# EAGLE design V001 (EAGLE 9.3.1)
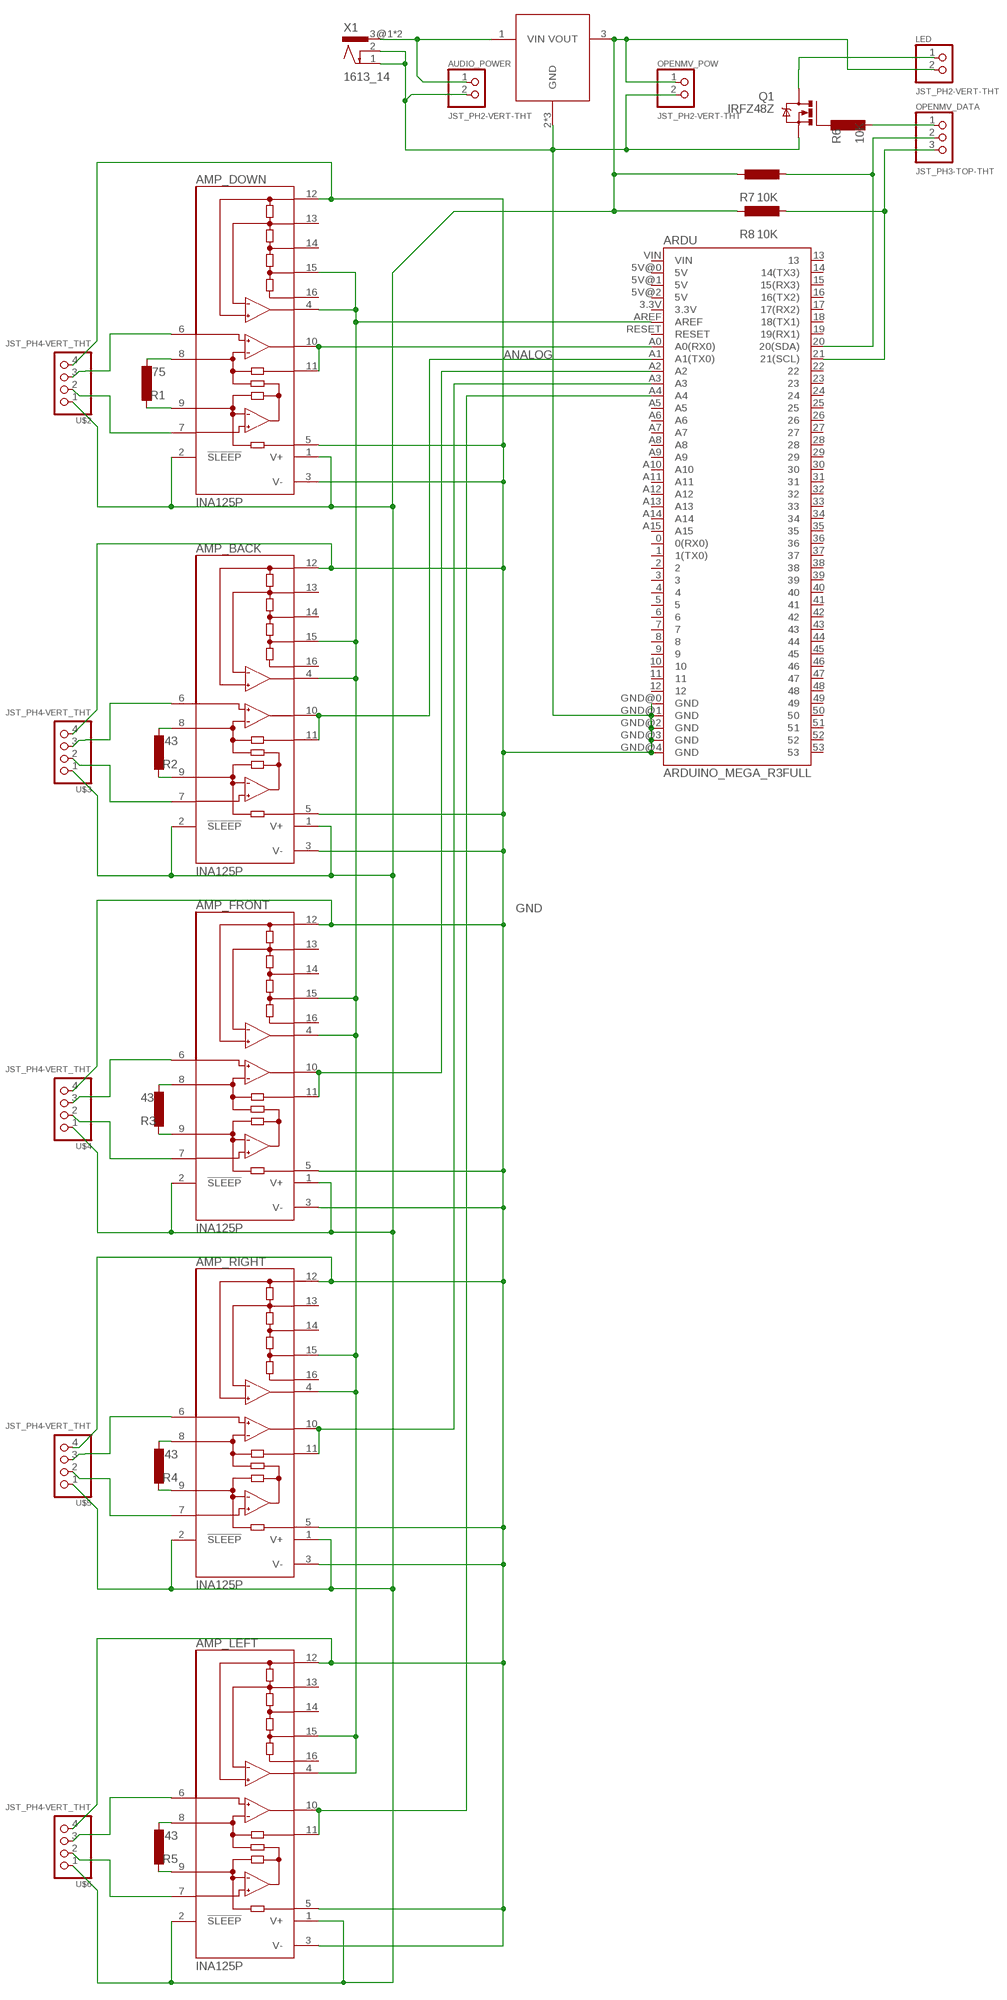
[diagram p0: schematic, sheet 1]

## Parts
AMP_BACK  INA125P  [DIL16]
AMP_DOWN  INA125P  [DIL16]
AMP_FRONT  INA125P  [DIL16]
AMP_LEFT  INA125P  [DIL16]
AMP_RIGHT  INA125P  [DIL16]
ARDU  ARDUINO_MEGA_R3FULL  [ARDUINO_MEGA]
AUDIO_POWER  JST_PH2-VERT-THT  [B2B-PH-K-S]
LED  JST_PH2-VERT-THT  [B2B-PH-K-S]
OPENMV_DATA  JST_PH3-TOP-THT  [B3B-PH-K-S]
OPENMV_POW  JST_PH2-VERT-THT  [B2B-PH-K-S]
Q1  IRFZ48Z  [TO220BH]
R1  75  L-EU0207/10  [0207/10]
R2  43  L-EU0207/10  [0207/10]
R3  43  L-EU0207/10  [0207/10]
R4  43  L-EU0207/10  [0207/10]
R5  43  L-EU0207/10  [0207/10]
R6  10K  L-EU0207/10  [0207/10]
R7  10K  L-EU0207/10  [0207/10]
R8  10K  L-EU0207/10  [0207/10]
U$1  TL780  [TO254P1651X1067X470-3]
U$2  JST_PH4-VERT_THT  [B4B-PH-K-S]
U$3  JST_PH4-VERT_THT  [B4B-PH-K-S]
U$4  JST_PH4-VERT_THT  [B4B-PH-K-S]
U$5  JST_PH4-VERT_THT  [B4B-PH-K-S]
U$6  JST_PH4-VERT_THT  [B4B-PH-K-S]
X1  1613_14  [1613_14]

## Nets
5V: AMP_BACK.1(V+) AMP_BACK.2(!SLEEP) AMP_DOWN.1(V+) AMP_DOWN.2(!SLEEP) AMP_FRONT.1(V+) AMP_FRONT.2(!SLEEP) AMP_LEFT.1(V+) AMP_LEFT.2(!SLEEP) AMP_RIGHT.1(V+) AMP_RIGHT.2(!SLEEP) LED.2 OPENMV_POW.1 R7.1 R8.1 U$1.3(VOUT) U$2.1 U$3.1 U$4.1 U$5.1 U$6.1
12V: AUDIO_POWER.1 U$1.1(VIN) X1.3@1 X1.3@2
ANALOG: AMP_DOWN.10(OUT) AMP_DOWN.11(SENSE) ARDU.A0(A0(RX0))
AREF: AMP_BACK.4(REFOUT) AMP_BACK.15(REF5) AMP_DOWN.4(REFOUT) AMP_DOWN.15(REF5) AMP_FRONT.4(REFOUT) AMP_FRONT.15(REF5) AMP_LEFT.4(REFOUT) AMP_LEFT.15(REF5) AMP_RIGHT.4(REFOUT) AMP_RIGHT.15(REF5) ARDU.AREF
GND: AMP_BACK.3(V-) AMP_BACK.5(REF) AMP_BACK.12(REFCOM) AMP_DOWN.3(V-) AMP_DOWN.5(REF) AMP_DOWN.12(REFCOM) AMP_FRONT.3(V-) AMP_FRONT.5(REF) AMP_FRONT.12(REFCOM) AMP_LEFT.3(V-) AMP_LEFT.5(REF) AMP_LEFT.12(REFCOM) AMP_RIGHT.3(V-) AMP_RIGHT.5(REF) AMP_RIGHT.12(REFCOM) ARDU.GND@0(GND) ARDU.GND@1(GND) ARDU.GND@2(GND) ARDU.GND@3(GND) ARDU.GND@4(GND) AUDIO_POWER.2 OPENMV_POW.2 Q1.S U$1.2(GND) U$1.4(GND) U$1.4.1(GND) U$2.4 U$3.4 U$4.4 U$5.4 U$6.4 X1.1 X1.2
N$3: AMP_DOWN.8(RG) R1.2
N$4: AMP_DOWN.9(RG) R1.1
N$5: AMP_BACK.8(RG) R2.2
N$6: AMP_BACK.9(RG) R2.1
N$7: AMP_DOWN.6(+IN) U$2.3
N$8: AMP_FRONT.8(RG) R3.2
N$9: AMP_FRONT.9(RG) R3.1
N$10: AMP_FRONT.10(OUT) AMP_FRONT.11(SENSE) ARDU.A2
N$11: AMP_RIGHT.8(RG) R4.2
N$12: AMP_RIGHT.9(RG) R4.1
N$13: AMP_RIGHT.10(OUT) AMP_RIGHT.11(SENSE) ARDU.A3
N$14: AMP_LEFT.8(RG) R5.2
N$15: AMP_LEFT.9(RG) R5.1
N$16: AMP_LEFT.10(OUT) AMP_LEFT.11(SENSE) ARDU.A4
N$17: AMP_DOWN.7(-IN) U$2.2
N$18: OPENMV_DATA.1 R6.2
N$19: AMP_BACK.10(OUT) AMP_BACK.11(SENSE) ARDU.A1(A1(TX0))
N$20: AMP_BACK.6(+IN) U$3.3
N$21: AMP_BACK.7(-IN) U$3.2
N$22: AMP_FRONT.6(+IN) U$4.3
N$23: AMP_FRONT.7(-IN) U$4.2
N$24: AMP_RIGHT.6(+IN) U$5.3
N$25: AMP_RIGHT.7(-IN) U$5.2
N$26: AMP_LEFT.6(+IN) U$6.3
N$27: AMP_LEFT.7(-IN) U$6.2
N$28: Q1.G R6.1
N$29: LED.1 Q1.D
N$30: ARDU.20(20(SDA)) OPENMV_DATA.2 R7.2
N$32: ARDU.21(21(SCL)) OPENMV_DATA.3 R8.2
Unconnected: AMP_BACK.13(REFBG) AMP_BACK.14(REF2.5) AMP_BACK.16(REF10) AMP_DOWN.13(REFBG) AMP_DOWN.14(REF2.5) AMP_DOWN.16(REF10) AMP_FRONT.13(REFBG) AMP_FRONT.14(REF2.5) AMP_FRONT.16(REF10) AMP_LEFT.13(REFBG) AMP_LEFT.14(REF2.5) AMP_LEFT.16(REF10) AMP_RIGHT.13(REFBG) AMP_RIGHT.14(REF2.5) AMP_RIGHT.16(REF10) ARDU.0(0(RX0)) ARDU.1(1(TX0)) ARDU.2 ARDU.3 ARDU.3.3V ARDU.4 ARDU.5 ARDU.5V@0(5V) ARDU.5V@1(5V) ARDU.5V@2(5V) ARDU.6 ARDU.7 ARDU.8 ARDU.9 ARDU.10 ARDU.11 ARDU.12 ARDU.13 ARDU.14(14(TX3)) ARDU.15(15(RX3)) ARDU.16(16(TX2)) ARDU.17(17(RX2)) ARDU.18(18(TX1)) ARDU.19(19(RX1)) ARDU.22 ARDU.23 ARDU.24 ARDU.25 ARDU.26 ARDU.27 ARDU.28 ARDU.29 ARDU.30 ARDU.31 ARDU.32 ARDU.33 ARDU.34 ARDU.35 ARDU.36 ARDU.37 ARDU.38 ARDU.39 ARDU.40 ARDU.41 ARDU.42 ARDU.43 ARDU.44 ARDU.45 ARDU.46 ARDU.47 ARDU.48 ARDU.49 ARDU.50 ARDU.51 ARDU.52 ARDU.53 ARDU.A5 ARDU.A6 ARDU.A7 ARDU.A8 ARDU.A9 ARDU.A10 ARDU.A11 ARDU.A12 ARDU.A13 ARDU.A14 ARDU.A15 ARDU.RESET ARDU.VIN

## Library data of the parts
AMP_BACK AMP_DOWN AMP_FRONT AMP_LEFT AMP_RIGHT = burr-brown:INA125: Instrumentation Amplifier with Precision Voltage Reference; MF: TEXAS INSTRUMENT CONNECTORS; MPN: INA125P; OC_FARNELL: 1459461; OC_NEWARK: 35C1726
ARDU = SparkFun-Boards:ARDUINO_MEGA_R3: Arduino Mega R3 ATmega2560 R3 compatible footprint. SparkFun Products: Arduino Mega 2560 R3 <https://www.sparkfun.com/products/11061>
AUDIO_POWER LED OPENMV_POW = ICST:JST_PH2
OPENMV_DATA = ICST:JST_PH3
Q1 = transistor-power:IRFZ48: N Channel HEXFET® Power MOSFET Logic Level Source: http://www.irf.com/product-info/datasheets/data/irfz48z.pdf
R1-R8 = rcl:L-EU: INDUCTOR, European symbol; SPICEPREFIX: L
U$1 = TO254P1651X1067X470-3:TL780
U$2-U$6 = ICST:JST_PH4
X1 = con-lumberg:1613_14: Power supply connectors / Netzgeräte-Steckverbinder Source: Data sheet <http://www.farnell.com/datasheets/1733496.pdf>; MF: LUMBERG; MPN: 1613 14; OC_FARNELL: 1243245

## Board
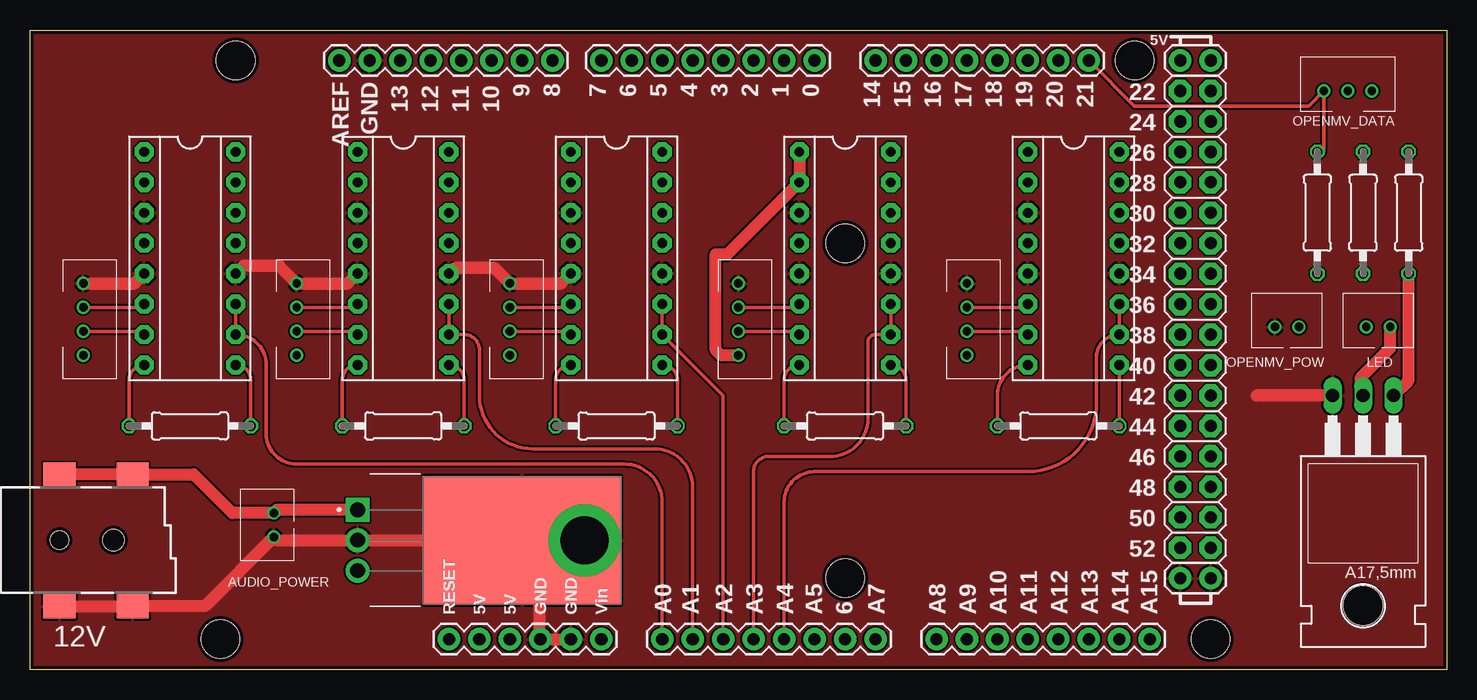
[diagram p1: board, top side]
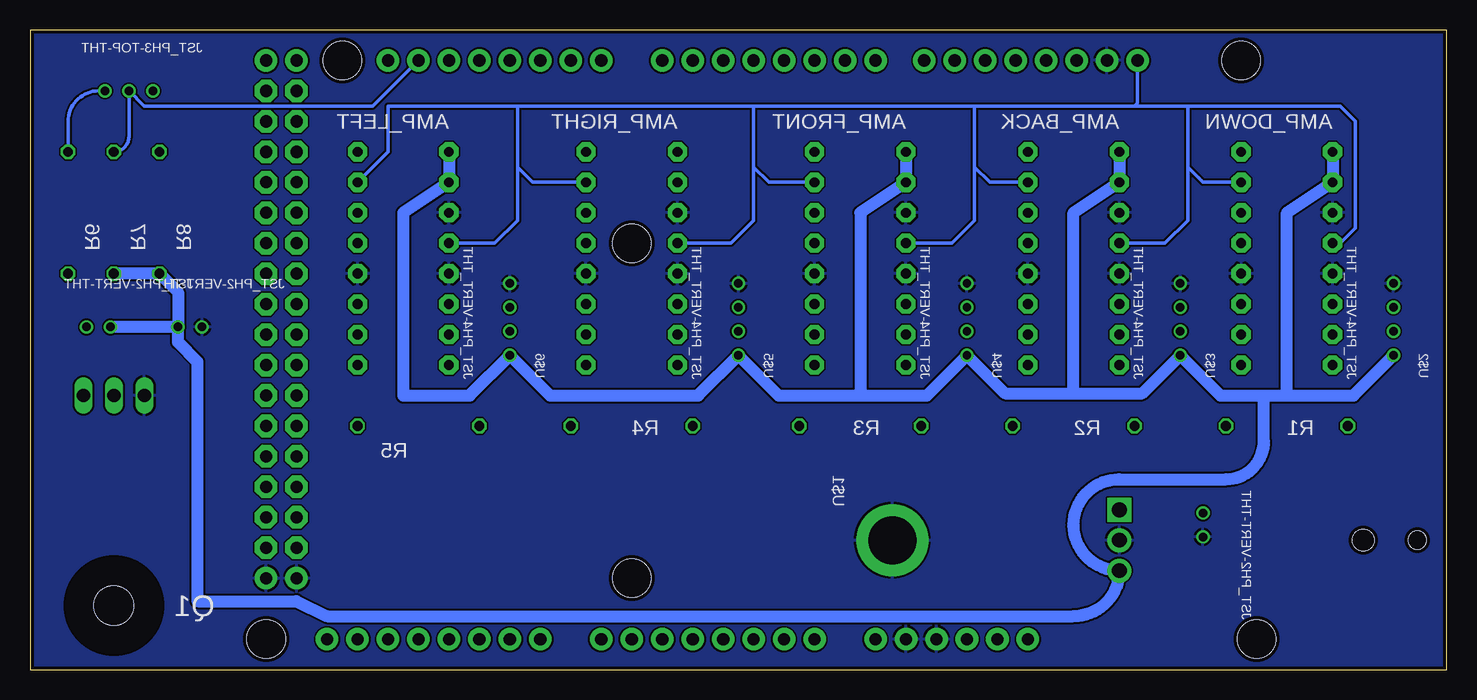
[diagram p2: board, bottom side, seen from below]

Size 118.11 x 53.34 mm. Coordinates in mm from the lower left corner, seen from the top.
Outline: 0,53.34 118.11,53.34 118.11,0 0,0 0,53.34
Copper layers (1*16): Top 0.035mm / dielectric 1.5mm / Bottom 0.035mm
Design rules "PCB-POOL Standard": minimum track width 0.15mm, minimum drill 0.3mm, track to track 0.15mm, track to pad 0.15mm, pad to pad 0.15mm, via to via 0.15mm, smd to smd 0.15mm, copper to edge 0.3mm, drill to drill 0.2mm, minimum pad ring 0.2mm, minimum via ring 0.15mm, stop-mask expansion 0.075mm, vias tented up to drill 0mil, thermal gap 0.2mm

### Footprints (pad centres in the part's own frame; a part is rotated, then mirrored left to right if it is on the bottom)
DIL16 = drill 0.813 pad 1.6 octagon: 1 -8.89,-3.81; 2 -6.35,-3.81; 3 -3.81,-3.81; 4 -1.27,-3.81; 5 1.27,-3.81; 6 3.81,-3.81; 7 6.35,-3.81; 8 8.89,-3.81; 9 8.89,3.81; 10 6.35,3.81; 11 3.81,3.81; 12 1.27,3.81; 13 -1.27,3.81; 14 -3.81,3.81; 15 -6.35,3.81; 16 -8.89,3.81
ARDUINO_MEGA = drill 1.016 pad 1.88: 0 13.97,24.13; 1 11.43,24.13; 2 8.89,24.13; 3 6.35,24.13; 3.3V -13.97,-24.13; 4 3.81,24.13; 5 1.27,24.13; 5V@0 -11.43,-24.13; 5V@1 44.45,24.13; 5V@2 46.99,24.13; 6 -1.27,24.13; 7 -3.81,24.13; 8 -7.874,24.13; 9 -10.414,24.13; 10 -12.954,24.13; 11 -15.494,24.13; 12 -18.034,24.13; 13 -20.574,24.13; 14 19.05,24.13; 15 21.59,24.13; 16 24.13,24.13; 17 26.67,24.13; 18 29.21,24.13; 19 31.75,24.13; 20 34.29,24.13; 21 36.83,24.13; A0 1.27,-24.13; A1 3.81,-24.13; A2 6.35,-24.13; A3 8.89,-24.13; A4 11.43,-24.13; A5 13.97,-24.13; A6 16.51,-24.13; A7 19.05,-24.13; A8 24.13,-24.13; A9 26.67,-24.13; A10 29.21,-24.13; A11 31.75,-24.13; A12 34.29,-24.13; A13 36.83,-24.13; A14 39.37,-24.13; A15 41.91,-24.13; AREF -25.654,24.13; GND@0 -8.89,-24.13; GND@1 -6.35,-24.13; GND@2 44.45,-19.05; GND@3 46.99,-19.05; GND@4 -23.114,24.13; RESET -16.51,-24.13; VIN -3.81,-24.13 | drill 1.016 pad 1.88 octagon: 22 44.45,21.59; 23 46.99,21.59; 24 44.45,19.05; 25 46.99,19.05; 26 44.45,16.51; 27 46.99,16.51; 28 44.45,13.97; 29 46.99,13.97; 30 44.45,11.43; 31 46.99,11.43; 32 44.45,8.89; 33 46.99,8.89; 34 44.45,6.35; 35 46.99,6.35; 36 44.45,3.81; 37 46.99,3.81; 38 44.45,1.27; 39 46.99,1.27; 40 44.45,-1.27; 41 46.99,-1.27; 42 44.45,-3.81; 43 46.99,-3.81; 44 44.45,-6.35; 45 46.99,-6.35; 46 44.45,-8.89; 47 46.99,-8.89; 48 44.45,-11.43; 49 46.99,-11.43; 50 44.45,-13.97; 51 46.99,-13.97; 52 44.45,-16.51; 53 46.99,-16.51 | hole 3.2: -34.29,24.13; -35.56,-24.13; 16.51,8.89; 16.51,-19.05; 40.64,24.13; 46.99,-24.13
B2B-PH-K-S = drill 0.7: 1 -1,0; 2 1,0
B3B-PH-K-S = drill 0.7: 1 -2,0; 2 0,0; 3 2,0
TO220BH = drill 1.118 long: D 0,-6.35; G -2.54,-6.35; S 2.54,-6.35 | hole 3.302: 0,11.176
0207/10 = drill 0.813 octagon: 1 -5.08,0; 2 5.08,0
TO254P1651X1067X470-3 = drill 1.24 pad 2 square: 1 0,0 | drill 1.24 pad 2: 2 2.54,0; 3 5.08,0 | smd 10.67 x 16.43: 4 2.54,13.75 | drill 4 pad 6: 4.1 2.54,18.925
B4B-PH-K-S = drill 0.7: 1 -3,0; 2 -1,0; 3 1,0; 4 3,0
1613_14 = smd 2 x 2.7: 1 5.5,5; 2 5.5,11.1; 3@1 -5.5,11.1; 3@2 -5.5,5 | hole 1.5: 0,5 | hole 1.8: 0,9.5

### Placement (x,y rotation side)
AMP_BACK  31.11,34.29 270 top
AMP_DOWN  13.34,34.29 270 top
AMP_FRONT  48.9,34.29 270 top
AMP_LEFT  86.99,34.29 270 top
AMP_RIGHT  67.94,34.29 270 top
ARDU  51.44,26.67 0 top
AUDIO_POWER  20.32,12.06 270 top
LED  112.39,28.57 180 top
OPENMV_DATA  109.85,48.26 180 top
OPENMV_POW  104.77,28.57 180 top
Q1  111.12,16.51 180 top
R1  13.34,20.32 180 top
R2  31.11,20.32 180 top
R3  48.9,20.32 180 top
R4  67.94,20.32 180 top
R5  85.72,20.32 180 top
R6  114.93,38.1 90 top
R7  111.12,38.1 90 top
R8  107.31,38.1 90 top
U$1  27.3,13.34 270 top
U$2  4.45,29.21 90 top
U$3  22.22,29.21 90 top
U$4  40.01,29.21 90 top
U$5  59.05,29.21 90 top
U$6  78.1,29.21 90 top
X1  -2.54,10.8 270 top

### Tracks (layer width: path | path; a pad name or v marks a point on that pad's centre or on a via)
5V
  Top 1.016: AMP_RIGHT.1 AMP_RIGHT.2 58.14,34.65 57.15,34.65 57.15,26.67 57.61,26.21 U$5.1
  Bottom 1.016: AMP_DOWN.1 AMP_DOWN.2 13.34,38.1 13.34,22.86 | AMP_BACK.1 AMP_BACK.2 31.11,38.1 31.11,23.03 | AMP_FRONT.1 AMP_FRONT.2 48.9,38.1 48.9,22.86 | AMP_LEFT.1 AMP_LEFT.2 86.99,38.1 86.99,22.86 81.45,22.86 U$6.1 74.75,22.86 62.41,22.86 U$5.1 55.71,22.86 48.9,22.86 | 15.24,22.86 15.24,19.05 arc90 18.41,15.88 27.3,15.88 arc-90 31.11,12.06 arc-90 U$1.3 arc90 31.11,4.44 93.34,4.44 95.88,5.71 104.14,5.71 104.14,25.67 105.77,27.3 OPENMV_POW.1 | 48.9,22.86 43.36,22.86 U$4.1 36.83,23.03 31.11,23.03 | 31.11,23.03 25.4,23.03 U$3.1 18.88,22.86 15.24,22.86 | 13.34,22.86 7.79,22.86 U$2.1 | 15.24,22.86 13.34,22.86 | R7.1 R8.1 105.77,31.48 OPENMV_POW.1 | OPENMV_POW.1 LED.2
12V
  Top 1.016: U$1.1 20.59,13.34 AUDIO_POWER.1 16.87,13.06 13.64,16.3 X1.3@1 X1.3@2
ANALOG
  Top 0.305: AMP_DOWN.11 AMP_DOWN.10 arc-90 19.68,25.4 19.68,19.68 arc90 22.22,17.14 49.53,17.14 arc-90 52.71,13.97 ARDU.A0
AREF
  Bottom 0.305: ARDU.AREF 25.78,47.24 26.04,46.99 | 26.04,46.99 21.59,46.99 | 21.59,46.99 8.89,46.99 7.62,45.72 7.62,36.83 8.89,35.56 AMP_DOWN.4 | 21.59,46.99 21.59,41.91 | 21.59,41.91 20.32,40.64 AMP_DOWN.15 | 21.59,41.91 21.59,37.47 23.49,35.56 AMP_BACK.4 | AMP_BACK.15 38.1,40.64 39.37,41.91 | 39.37,41.91 39.37,46.99 | 39.37,46.99 26.04,46.99 | 39.37,41.91 39.37,37.47 41.27,35.56 AMP_FRONT.4 | AMP_FRONT.15 56.52,40.64 57.79,41.91 | 57.79,41.91 57.79,46.99 | 57.79,46.99 39.37,46.99 | 57.79,41.91 57.79,37.47 59.69,35.56 AMP_RIGHT.4 | 77.47,41.91 76.2,40.64 AMP_RIGHT.15 | 77.47,41.91 77.47,46.99 | 77.47,46.99 57.79,46.99 | 77.47,41.91 77.47,37.47 79.38,35.56 AMP_LEFT.4 | 77.47,46.99 88.27,46.99 88.27,43.18 AMP_LEFT.15
GND
  Top 1.016: U$2.4 8.71,32.21 AMP_DOWN.5 | AMP_BACK.5 26.49,32.21 U$3.4 20.78,33.66 17.78,33.66 AMP_DOWN.12 | AMP_FRONT.5 44.27,32.21 U$4.4 38.73,33.48 35.39,33.48 AMP_BACK.12 | X1.1 X1.2 14.55,5.29 AUDIO_POWER.2 arc90 20.59,10.8 U$1.2 U$1.4.1 42.42,6.98 42.42,2.66 ARDU.GND@0 ARDU.GND@1 | Q1.S 102.23,22.86
  pour Bottom: 123.19,56.52 123.19,-5.08 -5.71,-5.08 -5.71,56.52
  pour Top: 123.19,56.52 123.19,-5.08 -1.27,-5.08 -1.27,56.52
N$3
  Top 0.305: AMP_DOWN.8 arc90 8.26,24.13 R1.2
N$4
  Top 0.305: AMP_DOWN.9 arc-90 18.41,24.13 R1.1
N$5
  Top 0.305: AMP_BACK.8 arc90 26.04,24.13 R2.2
N$6
  Top 0.305: AMP_BACK.9 arc-90 36.2,24.13 R2.1
N$7
  Top 0.305: U$2.3 9.26,30.21 AMP_DOWN.6
N$8
  Top 0.305: AMP_FRONT.8 arc90 43.82,24.13 R3.2
N$9
  Top 0.305: AMP_FRONT.9 arc-90 53.98,24.13 R3.1
N$10
  Top 0.305: AMP_FRONT.11 AMP_FRONT.10 57.79,22.86 ARDU.A2
N$11
  Top 0.305: AMP_RIGHT.8 arc90 62.87,24.13 R4.2
N$12
  Top 0.305: AMP_RIGHT.9 arc-90 73.02,24.13 R4.1
N$13
  Top 0.305: AMP_RIGHT.11 AMP_RIGHT.10 70.48,27.94 arc90 69.85,27.3 69.85,20.95 arc-90 66.67,17.78 61.59,17.78 arc90 60.33,16.51 ARDU.A3
N$14
  Top 0.305: AMP_LEFT.8 arc90 80.64,22.86 R5.2
N$15
  Top 0.305: AMP_LEFT.9 R5.1
N$16
  Top 0.305: AMP_LEFT.11 AMP_LEFT.10 arc90 88.9,26.03 88.9,22.23 arc-90 83.18,16.51 65.41,16.51 arc90 62.87,13.97 ARDU.A4
N$17
  Top 0.305: U$2.2 9.26,28.21 AMP_DOWN.7
N$18
  Bottom 0.305: R6.2 114.93,45.72 arc90 112.39,48.26 OPENMV_DATA.1
N$19
  Top 0.305: AMP_BACK.11 AMP_BACK.10 36.2,27.94 arc-90 37.47,26.67 37.47,22.86 arc90 41.91,18.41 52.07,18.41 arc-90 55.25,15.24 ARDU.A1
N$20
  Top 0.305: U$3.3 27.04,30.21 AMP_BACK.6
N$21
  Top 0.305: U$3.2 27.04,28.21 AMP_BACK.7
N$22
  Top 0.305: U$4.3 44.82,30.21 AMP_FRONT.6
N$23
  Top 0.305: U$4.2 44.82,28.21 AMP_FRONT.7
N$24
  Top 0.305: U$5.3 63.87,30.21 AMP_RIGHT.6
N$25
  Top 0.305: U$5.2 63.87,28.21 AMP_RIGHT.7
N$26
  Top 0.305: U$6.3 82.91,30.21 AMP_LEFT.6
N$27
  Top 0.305: U$6.2 82.91,28.21 AMP_LEFT.7
N$28
  Top 1.016: Q1.G 114.93,24.13 R6.1
N$29
  Top 1.016: Q1.D 110.9,23.09 110.9,24.32 113.39,26.82 LED.1
N$30
  Bottom 0.305: R7.2 arc-90 109.85,44.45 OPENMV_DATA.2 108.58,46.99 89.53,46.99 ARDU.20
N$32
  Top 0.305: R8.2 107.85,43.18 OPENMV_DATA.3 106.58,46.99 92.07,46.99 ARDU.21

### Text on the board
tNames: 12V